# EAGLE design TLV493D-Board_RevB (EAGLE 9.6.2)
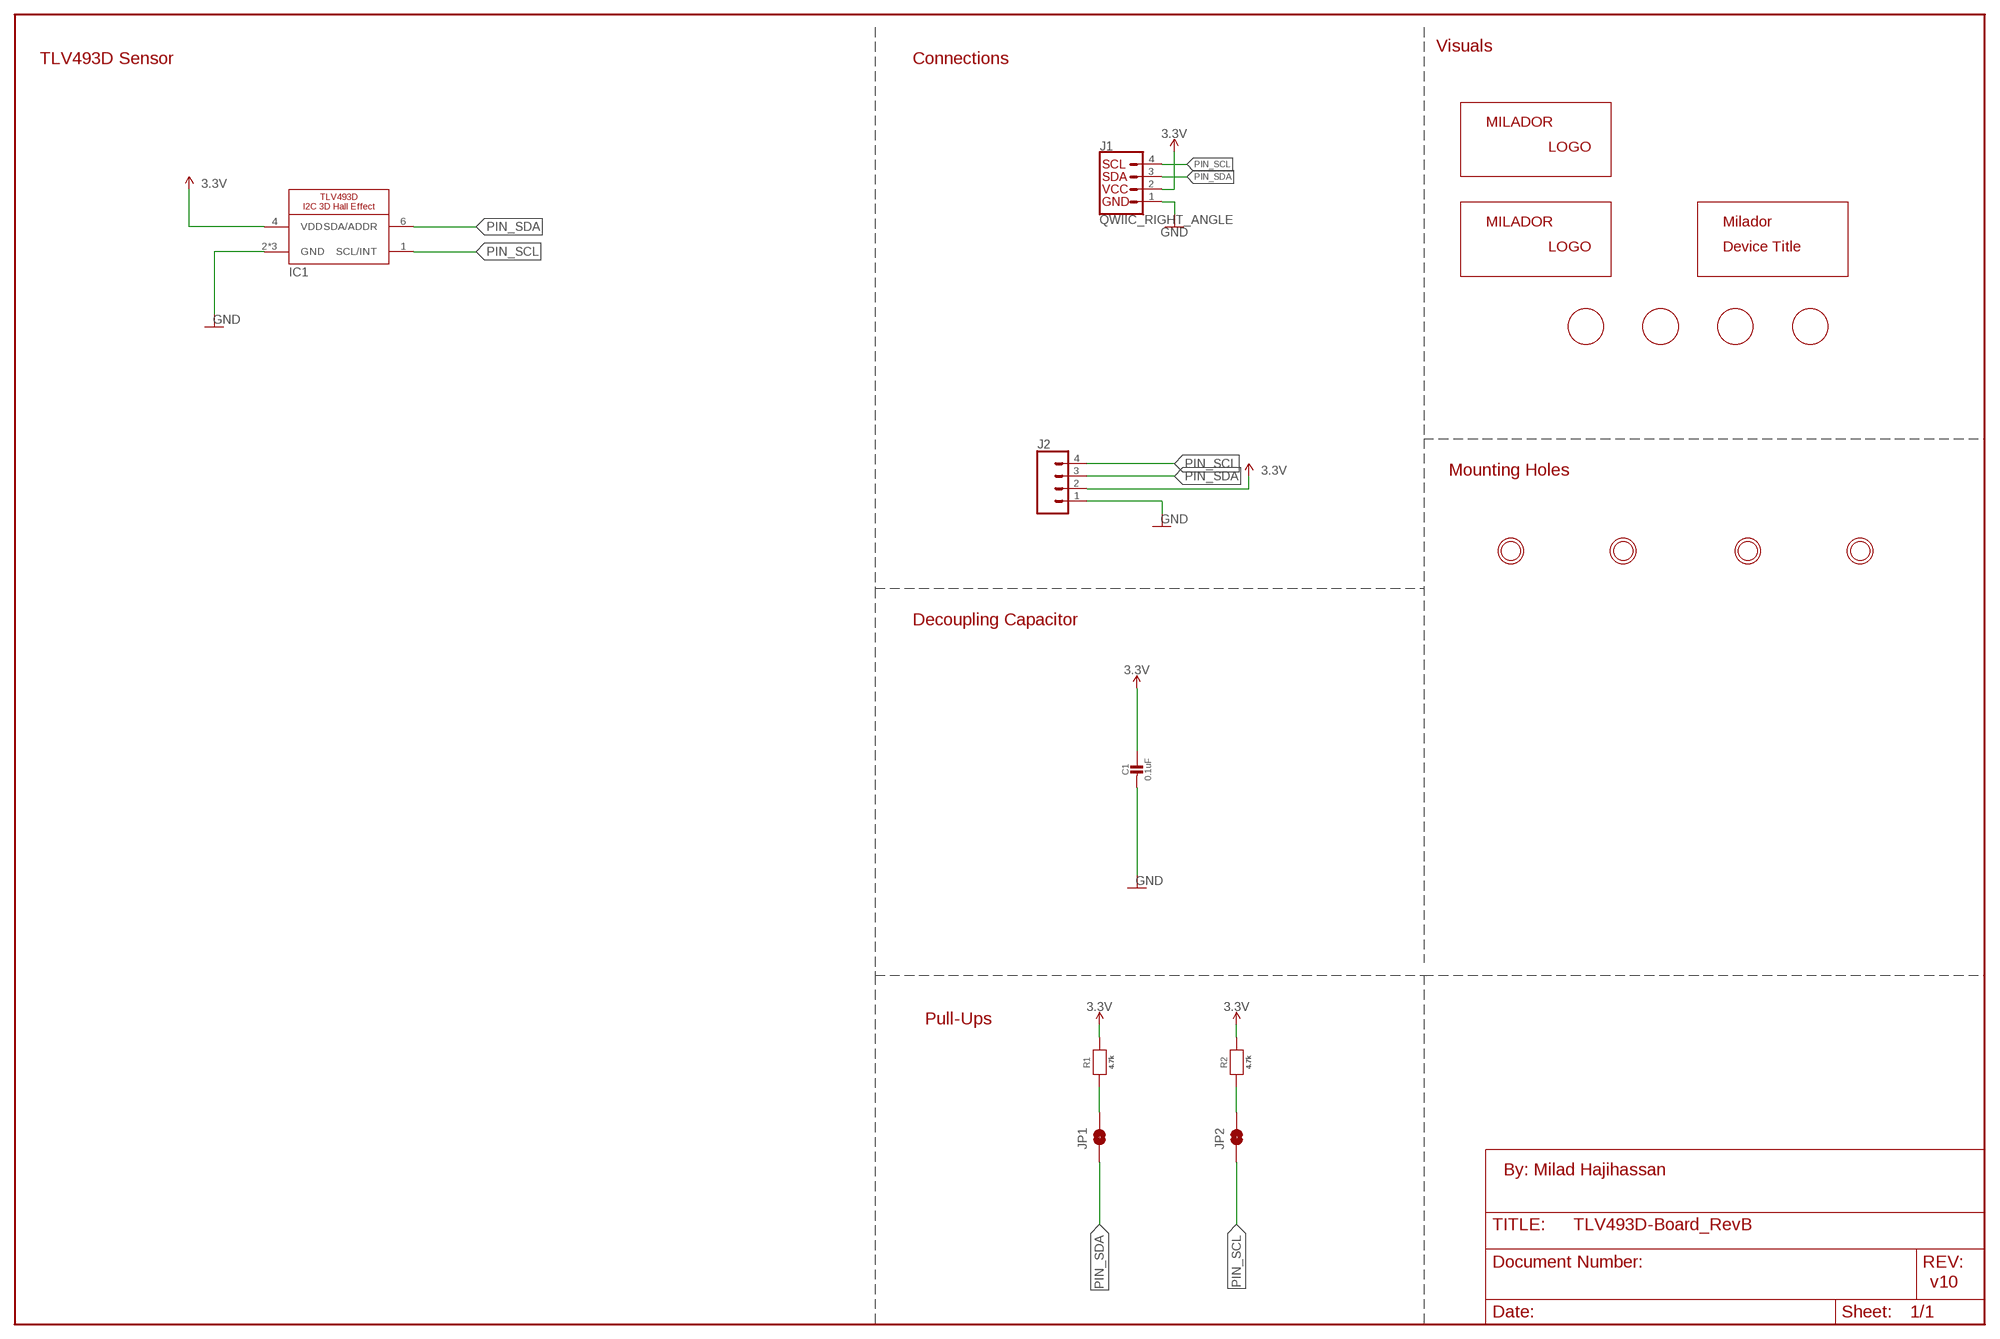
[diagram p0: schematic, sheet 1]

## Parts
C1  0.1uF  CAP_CERAMIC-0805  [0805]
IC1  TLV493D  [SOT23-6]
J1  QWIIC_RIGHT_ANGLE  QWIIC_CONNECTORSJS-1MM  [CONNECTORS_JST04_1MM_RA]
J2  CONNECTORS_CONN_041X04_NO_SILK  [CONNECTORS_1X04_NO_SILK]
JP1  JUMPERS-SMT_2_NC_TRACE_SILK  [JUMPERS_SMT-JUMPER_2_NC_TRACE_SILK]
JP2  JUMPERS-SMT_2_NC_TRACE_SILK  [JUMPERS_SMT-JUMPER_2_NC_TRACE_SILK]
LABE_SCL_BOTTOM  MILADOR-LABEL-SCL  [LABEL-SCL]
LABE_SDA_BOTTOM  MILADOR-LABEL-SDA  [LABEL-SDA]
LABEL_3V_BOTTOM  MILADOR-LABEL-3V  [LABEL-3V]
LABEL_GND_BOTTOM  MILADOR-LABEL-GND  [LABEL-GND]
LABEL_MILADOR_BOTTOM  MILADOR-LOGO-  [MILADOR_LOGO1]
LABEL_MILADOR_TLV493D_BOTTOM  MILADOR-DEVICE-TLV493D_BOARD  [MILADOR_TLV493D_BOARD]
LABEL_MILADOR_TOP  MILADOR-LOGO-  [MILADOR_LOGO1]
M1  MOUNTINGHOLE2.5  [MOUNTINGHOLE_2.5_PLATED]
M2  MOUNTINGHOLE2.5  [MOUNTINGHOLE_2.5_PLATED]
M3  MOUNTINGHOLE2.5  [MOUNTINGHOLE_2.5_PLATED]
M4  MOUNTINGHOLE2.5  [MOUNTINGHOLE_2.5_PLATED]
R1  4.7k  RESISTOR-0603-NOOUT  [0603-NO]
R2  4.7k  RESISTOR-0603-NOOUT  [0603-NO]

## Nets
3.3V: C1.1 IC1.4(VDD) J1.2 J2.2 R1.2 R2.2
GND: C1.2 IC1.2(GND) IC1.3(GND) IC1.5(GND) J1.1 J2.1
N$3: JP1.2 R1.1
N$9: JP2.2 R2.1
PIN_SCL: IC1.1(SCL/INT) J1.4 J2.4 JP2.1
PIN_SDA: IC1.6(SDA/ADDR) J1.3 J2.3 JP1.1

## Notes on the sheet
- Visuals
- TLV493D Sensor | Connections
- Mounting Holes
- Decoupling Capacitor
- Pull-Ups
- By: Milad Hajihassan
- v10

## Library data of the parts
C1 = MMC_SMD:CAP_CERAMIC-: Ceramic Capacitors For new designs, use the packages preceded by an '_' character since they are more reliable: The following footprints should be used on most boards: _0402 - Standard footprint for regular board layouts _0603 - Standard footprint for regular board layouts _0805 - Standard footprint for regular board layouts _1206 - Standard footprint for regular board layouts For extremely tight-pitch boards where space is at a premium, the following 'micro-pitch' footprints can be used (smaller pads, no silkscreen outline, etc.): _0402MP - Micro-pitch footprint for very dense/compact boards _0603MP - Micro-pitch footprint for very dense/compact boards _0805MP - Micro-pitch footprint for very dense/compact boards _1206MP - Micro-pitch footprint for very dense/compact boards
IC1 = MMC_SMD:TLV493D
J1 = milador_SMD:QWIIC_CONNECTORS: SparkFun I2C Standard Qwiic Connector An SMD 1mm pitch JST connector makes it easy and quick (get it? Qwiic?) to connect I2C devices to each other. The Qwiic system <http://www.sparkfun.com/qwiic> enables fast and solderless connection between popular platforms and various sensors and actuators. We carry 200mm <https://www.sparkfun.com/products/14204>, 100mm <https://www.sparkfun.com/products/14205>, 50mm <https://www.sparkfun.com/products/14206>, and breadboard friendly <https://www.sparkfun.com/products/14207> Qwiic cables. We also offer 10 pcs strips <https://www.sparkfun.com/products/14323> the SMD connectors.; PROD_ID: CONN-13694
J2 = milador:CONNECTORS_CONN_04: Multi connection point. Often used as Generic Header-pin footprint for 0.1 inch spaced/style header connections On any of the 0.1 inch spaced packages, you can populate with these: Break Away Headers - Straight <https://www.sparkfun.com/products/116> (PRT-00116) Break Away Male Headers - Right Angle <https://www.sparkfun.com/products/553> (PRT-00553) Female Headers <https://www.sparkfun.com/products/115> (PRT-00115) Break Away Headers - Machine Pin <https://www.sparkfun.com/products/117> (PRT-00117) Break Away Female Headers - Swiss Machine Pin <https://www.sparkfun.com/products/743> (PRT-00743) For SCREWTERMINALS and SPRING TERMINALS visit here: Screw Terimnals on SparkFun.com <https://www.sparkfun.com/search/results?term=Screw+Terminals> (5mm/3.5mm/2.54mm spacing) This device is also useful as a general connection point to wire up your design to another part of your project. Our various solder wires solder well into these plated through hole pads. Hook-Up Wire - Assortment (Stranded, 22 AWG) <https://www.sparkfun.com/products/11375> (PRT-11375) Hook-Up Wire - Assortment (Solid Core, 22 AWG) <https://www.sparkfun.com/products/11367> (PRT-11367) View the entire wire category on our website here <https://www.sparkfun.com/categories/141> Special notes: Molex polarized connector foot print use with SKU : PRT-08231 with associated crimp pins and housings. 1MM SMD Version SKU: PRT-10208; PROD_ID: CONN-09696
JP1 JP2 = milador_SMD:JUMPERS-SMT_2_NC_TRACE: Normally closed trace jumper This jumper has a trace between two pads so it's normally closed (NC). Use a razor knife to open the connection. For best results follow the IPC guidelines for cutting traces: Cutout at least 0.063 mm (0.005 in). Remove all loose material to clean up the cut area. Seal the cut with an approved epoxy. Reapply solder to reclose the connection.
LABE_SCL_BOTTOM LABE_SDA_BOTTOM LABEL_3V_BOTTOM LABEL_GND_BOTTOM = milador:MILADOR-LABEL-
LABEL_MILADOR_BOTTOM LABEL_MILADOR_TOP = milador:MILADOR-LOGO-
LABEL_MILADOR_TLV493D_BOTTOM = milador:MILADOR-DEVICE-
M1-M4 = milador:MOUNTINGHOLE: Mounting Hole For #2 screws (0.086"/2.18mm width, 0.094"/2.4mm hole) use 2.5mm; BOM: EXCLUDE
R1 R2 = milador_SMD:RESISTOR-: Resistors For new designs, use the packages preceded by an '_' character since they are more reliable: The following footprints should be used on most boards: _0402 - Standard footprint for regular board layouts _0603 - Standard footprint for regular board layouts _0805 - Standard footprint for regular board layouts _1206 - Standard footprint for regular board layouts For extremely tight-pitch boards where space is at a premium, the following 'micro-pitch' footprints can be used (smaller pads, no silkscreen outline, etc.): _0402MP - Micro-pitch footprint for very dense/compact boards _0603MP - Micro-pitch footprint for very dense/compact boards _0805MP - Micro-pitch footprint for very dense/compact boards _1206MP - Micro-pitch footprint for very dense/compact boards

## Board
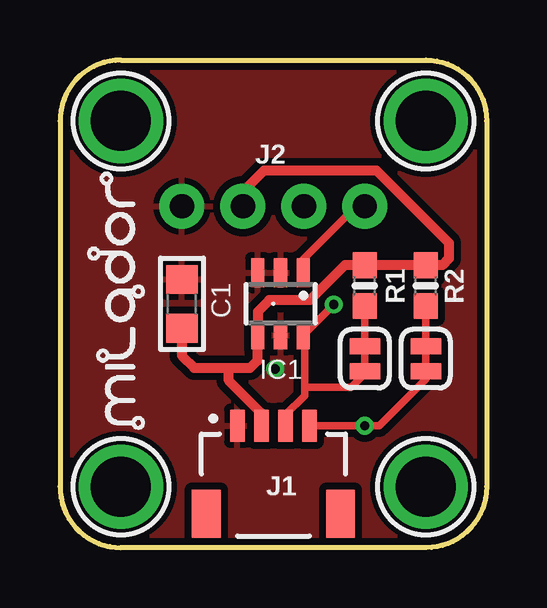
[diagram p1: board, top side]
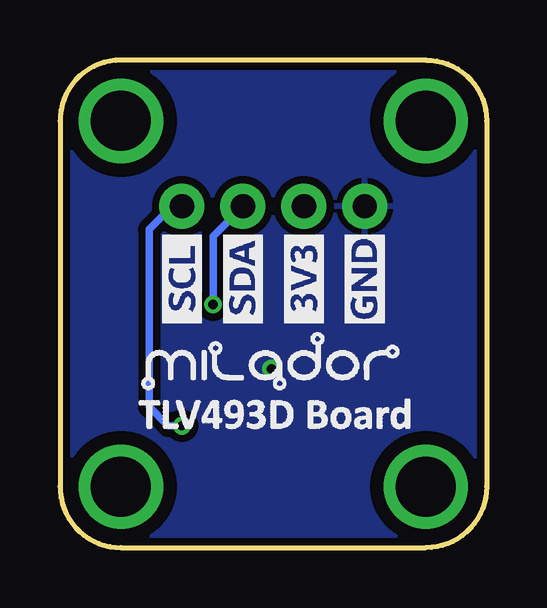
[diagram p2: board, bottom side, seen from below]

Size 17.78 x 20.32 mm. Coordinates in mm from the lower left corner, seen from the top.
Outline: 2.54,20.32 15.24,20.32 arc-90 17.78,17.78 17.78,2.54 arc-90 15.24,0 2.54,0 arc-90 0,2.54 0,17.78 arc-90 2.54,20.32
Copper layers (1*16): Top 0.035mm / dielectric 1.5mm / Bottom 0.035mm
Design rules "SparkFun-2-layer-TIGHT *": minimum track width 7mil, minimum drill 15mil, track to track 1mil, track to pad 1mil, pad to pad 1mil, via to via 1mil, smd to smd 1mil, copper to edge 7mil, drill to drill 7mil, minimum pad ring 7mil, minimum via ring 7mil, stop-mask expansion 4mil, vias tented up to drill 25mil, thermal gap 10mil

### Footprints (pad centres in the part's own frame; a part is rotated, then mirrored left to right if it is on the bottom)
0805 = smd 1.2 x 1.3: 1 -1.016,0; 2 1.016,0
SOT23-6 = smd 0.55 x 1.2: 1 -0.95,-1.3; 2 0,-1.3; 3 0.95,-1.3; 4 0.95,1.3; 5 0,1.3; 6 -0.95,1.3
CONNECTORS_JST04_1MM_RA = smd 0.6 x 1.35: 1 -1.5,0; 2 -0.5,0; 3 0.5,0; 4 1.5,0 | smd 1.2 x 2: NC1 2.8,-3.675; NC2 -2.8,-3.675
CONNECTORS_1X04_NO_SILK = drill 1.016 pad 1.88: 1 0,0; 2 2.54,0; 3 5.08,0; 4 7.62,0
JUMPERS_SMT-JUMPER_2_NC_TRACE_SILK = smd 0.66 x 1.27: 1 -0.521,0; 2 0.521,0
MOUNTINGHOLE_2.5_PLATED = drill 2.5 pad 3.2: P$1 0,0
0603-NO = smd 1.075 x 1: 1 -0.85,0; 2 0.85,0

### Placement (x,y rotation side)
C1  5.08,10.16 90 top
IC1  9.19,10.16 180 top
J1  8.89,5.08 0 top
J2  5.08,14.22 0 top
JP1  12.7,7.87 90 top
JP2  15.24,7.87 90 top
LABE_SCL_BOTTOM  12.7,9.4 90 bottom
LABE_SDA_BOTTOM  10.16,9.4 90 bottom
LABEL_3V_BOTTOM  7.62,9.4 90 bottom
LABEL_GND_BOTTOM  5.08,9.4 90 bottom
LABEL_MILADOR_BOTTOM  8.89,6.6 0 bottom
LABEL_MILADOR_TLV493D_BOTTOM  8.84,5.59 0 bottom
LABEL_MILADOR_TOP  3.5,10.41 90 top
M1  2.54,2.54 0 top
M2  15.24,2.54 0 top
M3  2.54,17.78 0 top
M4  15.24,17.78 0 top
R1  12.7,10.92 90 top
R2  15.24,10.92 90 top

### Tracks (layer width: path | path; a pad name or v marks a point on that pad's centre or on a via)
3.3V
  Top 0.406: C1.1 5.08,8 5.59,7.49 7.04,7.49 | 7.04,7.49 7.92,7.49 8.24,7.81 IC1.4 8.24,9.84 8.71,10.31 10.41,10.31 11.87,11.77 R1.2 R2.2 15.94,11.77 16.2,12.04 16.2,12.7 13.18,15.72 8.51,15.72 7.62,14.83 J2.2 | J1.2 8.39,5.61 7.04,6.96 7.04,7.49
GND  (via drill 0.4)
  other vias: 8.97,7.45
  pour Bottom (isolate 0.305): 0,20.32 17.78,20.32 17.78,0 0,0
  pour Top (isolate 0.305): 0,20.32 17.78,20.32 17.78,0 0,0
N$3
  Top 0.305: JP1.2 R1.1
N$9
  Top 0.305: JP2.2 R2.1
PIN_SCL  (via drill 0.38)
  Top 0.305: JP2.1 15.24,7.02 13.3,5.08 v12.7,5.08 J1.4 | IC1.1 10.14,12.02 12.34,14.22 J2.4
  Bottom 0.305: v12.7,5.08 13.28,5.08 14.07,5.87 14.07,13.26 13.11,14.22 J2.4
PIN_SDA  (via drill 0.38)
  Top 0.305: J1.3 9.39,5.53 10.19,6.33 10.19,6.68 | JP1.1 12.7,7.25 12.13,6.68 10.19,6.68 | 10.19,6.68 10.19,8.81 IC1.6 v11.4,10.12 v11.4,10.13
  Bottom 0.305: J2.3 11.4,12.98 v11.4,10.13